# Altium schematic sheet CATS-GS-GNSS.SchDoc: CATS Groundstation
size A4; DocumentNumber: Overview; Revision: V1.0; SheetNumber: 9; SheetTotal: 9; Author: Luca Jost; Subtitle: GNSS
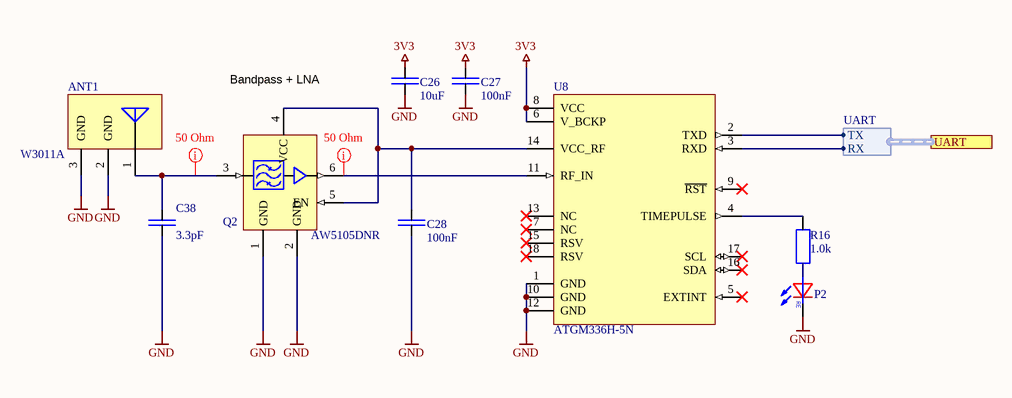
[diagram p0: CATS-GS-GNSS.SchDoc]

## Parts
ANT1  W3011A  [SMD Antenna W3011A]
C26  10uF  [SMD Keramikkondensator 0603]
C27  100nF  [SMD Keramikkondensator 0402]
C28  100nF  [SMD Keramikkondensator 0402]
C38  3.3pF  [SMD Keramikkondensator 0402]
P2  LED  [SMD LED 0603]  (value not drawn)
Q2  AW5105DNR  [SMD LNA AW5105DNR]
R16  1.0k  [SMD Widerstand 0402]
U8  ATGM336H-5N  [SMD MAX-8]

## Ports
UART (harness UART)

## Harnesses
UART: TX, RX

## Nets
3V3: C26.2 C27.2 U8.6(V_BCKP) U8.8(VCC)
GND: ANT1.2(GND) ANT1.3(GND) C26.1 C27.1 C28.1 C38.1 P2.K Q2.1(GND) Q2.2(GND) U8.1(GND) U8.10(GND) U8.12(GND)
NetANT1_1: ANT1.1 C38.2 Q2.3
NetC28_2: C28.2 Q2.4(VCC) Q2.5(EN) U8.14(VCC_RF)
NetP2_A: P2.A R16.1
NetQ2_6: Q2.6(EN) U8.11(RF_IN)
NetR16_2: R16.2 U8.4(TIMEPULSE)
NetU8_2: U8.2(TXD) ; port UART.TX
NetU8_3: U8.3(RXD) ; port UART.RX

Not connected (* = marked no-connect by the designer): U8 5(EXTINT)* 7(NC)* 9(~{RST})* 13(NC)* 15(RSV)* 16(SDA)* 17(SCL)* 18(RSV)*

## Layout directives
rule Impedance Constraint [Min = 50.00    Max = 50.00    ]; net class RF-Line 50: NetANT1_1, NetQ2_6

## Notes on the sheet
- (near Q2) Bandpass + LNA
- Title
- Author:
- Subtitle
- Date:
- Rev:
- File:
- Sheet
- of
- (in symbol LED) RE

## Library data of the parts
ANT1 = W3011A: RF ANT 1.575GHZ CHIP SOLDER SMD; ComponentLink1Description: Datasheet; ComponentLink1URL: https://media.digikey.com/pdf/Data%20Sheets/Pulse%20PDFs/W3011A_DS.pdf; Digikey: 553-1671-1-ND
C26 = E6 - 10uF: SMD Ceramic Capacitor E6; Unit Price: 0.01; JLC: C70225
C27 C28 = E6 - 100nF: SMD Ceramic Capacitor E6; Unit Price: 0.01; JLC: C307331
C38 = E6 - 3.3nF: SMD Ceramic Capacitor E6; Unit Price: 0.01; Number: -; JLC: C1565
P2 = LED: Color LED; JLC: C2286
Q2 = AW5105DNR: BDS/GPS/GNSS INTEGRATED FRONT-END MODULE WITH / LOW NOISE AMPLIFIER AND FILTER; ComponentLink1Description: Datasheet; ComponentLink1URL: https://datasheet.lcsc.com/lcsc/2008041805_AWINIC-Shanghai-Awinic-Tech-AW5105DNR_C506193.pdf; JLC: C506193
R16 = E24 - 1.0k: SMD Chip Resistor E24; Unit Price: 0.01; Number: -; Supplier: -; JLC: C11702
U8 = ATGM336H-5N: Chinese Crap GNSS Module; ComponentLink1Description: Datasheet; ComponentLink1URL: https://datasheet.lcsc.com/lcsc/1810261521_ZHONGKEWEI-ATGM336H-5N31_C90770.pdf; JLC: C90770